# EAGLE schematic PCB30011-R2519 (EAGLE 5.06)
DM: 0; DR: 180.000; DX: 72.400; DY: 3.000; SHEETNO: 3

## Sheet 1 of 7
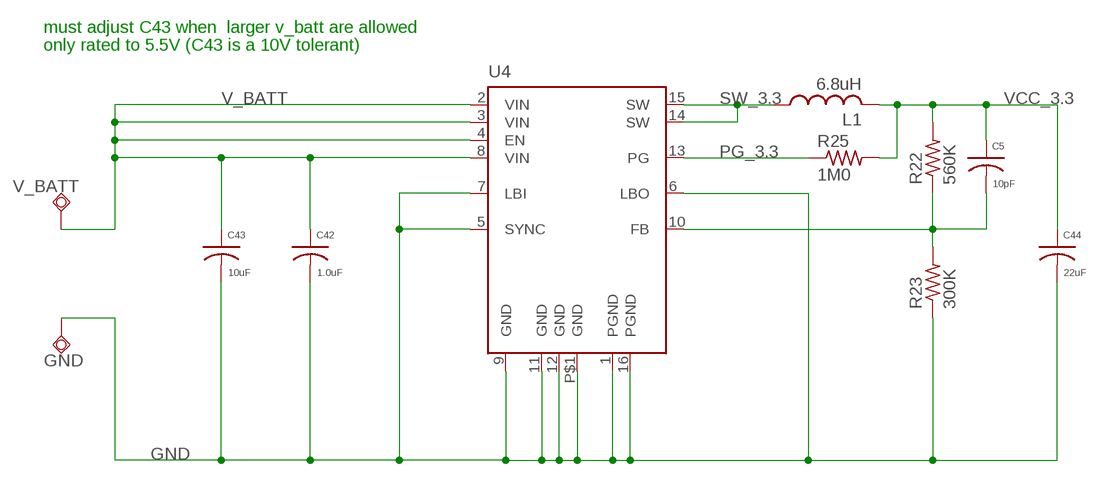
[diagram p0: schematic, sheet 1]

### Parts
C5  10pF  C0402  [C0402]
C42  1.0uF  C0603  [C0603]
C43  10uF  C0805  [C0805]
C44  22uF  C0805-R  [C0805R]
GND  TPSQPAD1-17  [P1-17]
L1  6.8uH  LELL3GM  [ELL3GM]
R22  560K  R0402-R  [C0402R]
R23  300K  R0402-R  [C0402R]
R25  1M0  R0402-R  [C0402R]
U4  TPS62110  TPS62111  [PQFP16]
V_BATT  TPSQPAD1-17  [P1-17]

### Nets
FB_3.3: C5.2 R22.1 R23.2 U4.10(FB)
GND [xxwide]: C42.2 C43.2 C44.2 GND.1(TP) R23.1 U4.1(PGND) U4.5(SYNC) U4.6(LBO) U4.7(LBI) U4.9(GND) U4.11(GND) U4.12(GND) U4.16(PGND) U4.P$1(GND) ; also sheet 2,3,4,5,6,7
PG_3.3: R25.1 U4.13(PG)
SW_3.3: L1.1 U4.14(SW) U4.15(SW)
V_BATT [xxwide]: C42.1 C43.1 U4.2(VIN) U4.3(VIN) U4.4(EN) U4.8(VIN) V_BATT.1(TP) ; also sheet 5
VCC_3.3 [supply]: C5.1 C44.1 L1.2 R22.2 R25.2 ; also sheet 3,4,5,6,7

### Notes on the sheet
- must adjust C43 when  larger v_batt are allowed
- only rated to 5.5V (C43 is a 10V tolerant)

## Sheet 2 of 7
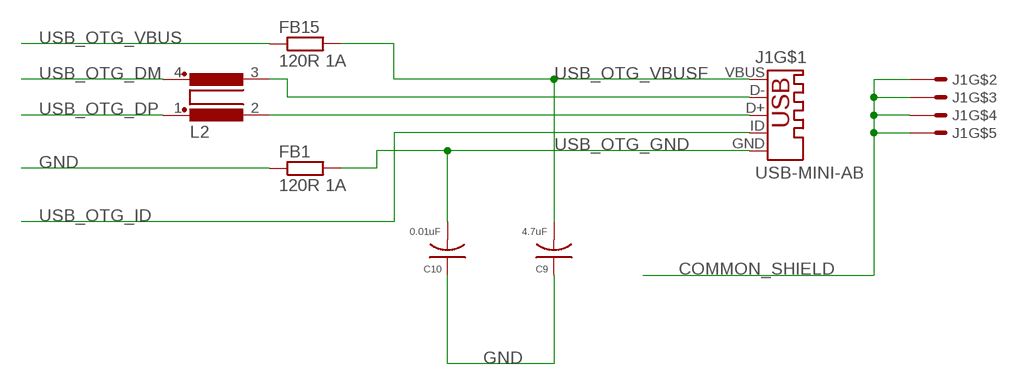
[diagram p1: schematic, sheet 2]

### Parts
C9  4.7uF  C0603-R  [C0603R]
C10  0.01uF  C0402  [C0402]
FB1  120R 1A  FB0402  [C0402]
FB15  120R 1A  FB0402  [C0402]
J1  USB-MINI-AB  USB-B  [USB-B-SMT]
L2  COM_MODE_CHOKE  [0504-DLP11S]

### Nets
COMMON_SHIELD: J1.P1(S) J1.P2(S) J1.P3(S) J1.P4(S)
GND [xxwide]: C9.1 C10.1 FB1.1 ; also sheet 1,3,4,5,6,7
USB_DM: J1.D-(2_D-) L2.3
USB_DP: J1.D+(3_D+) L2.2
USB_OTG_DM [USB]: L2.4 ; also sheet 3
USB_OTG_DP [USB]: L2.1 ; also sheet 3
USB_OTG_GND: C10.2 FB1.2 J1.GND(5_GND)
USB_OTG_ID: J1.ID(4_ID) ; also sheet 3
USB_OTG_VBUS [xxwide]: FB15.1 ; also sheet 3
USB_OTG_VBUSF: C9.2 FB15.2 J1.VBUS(1_VBUS)

## Sheet 3 of 7
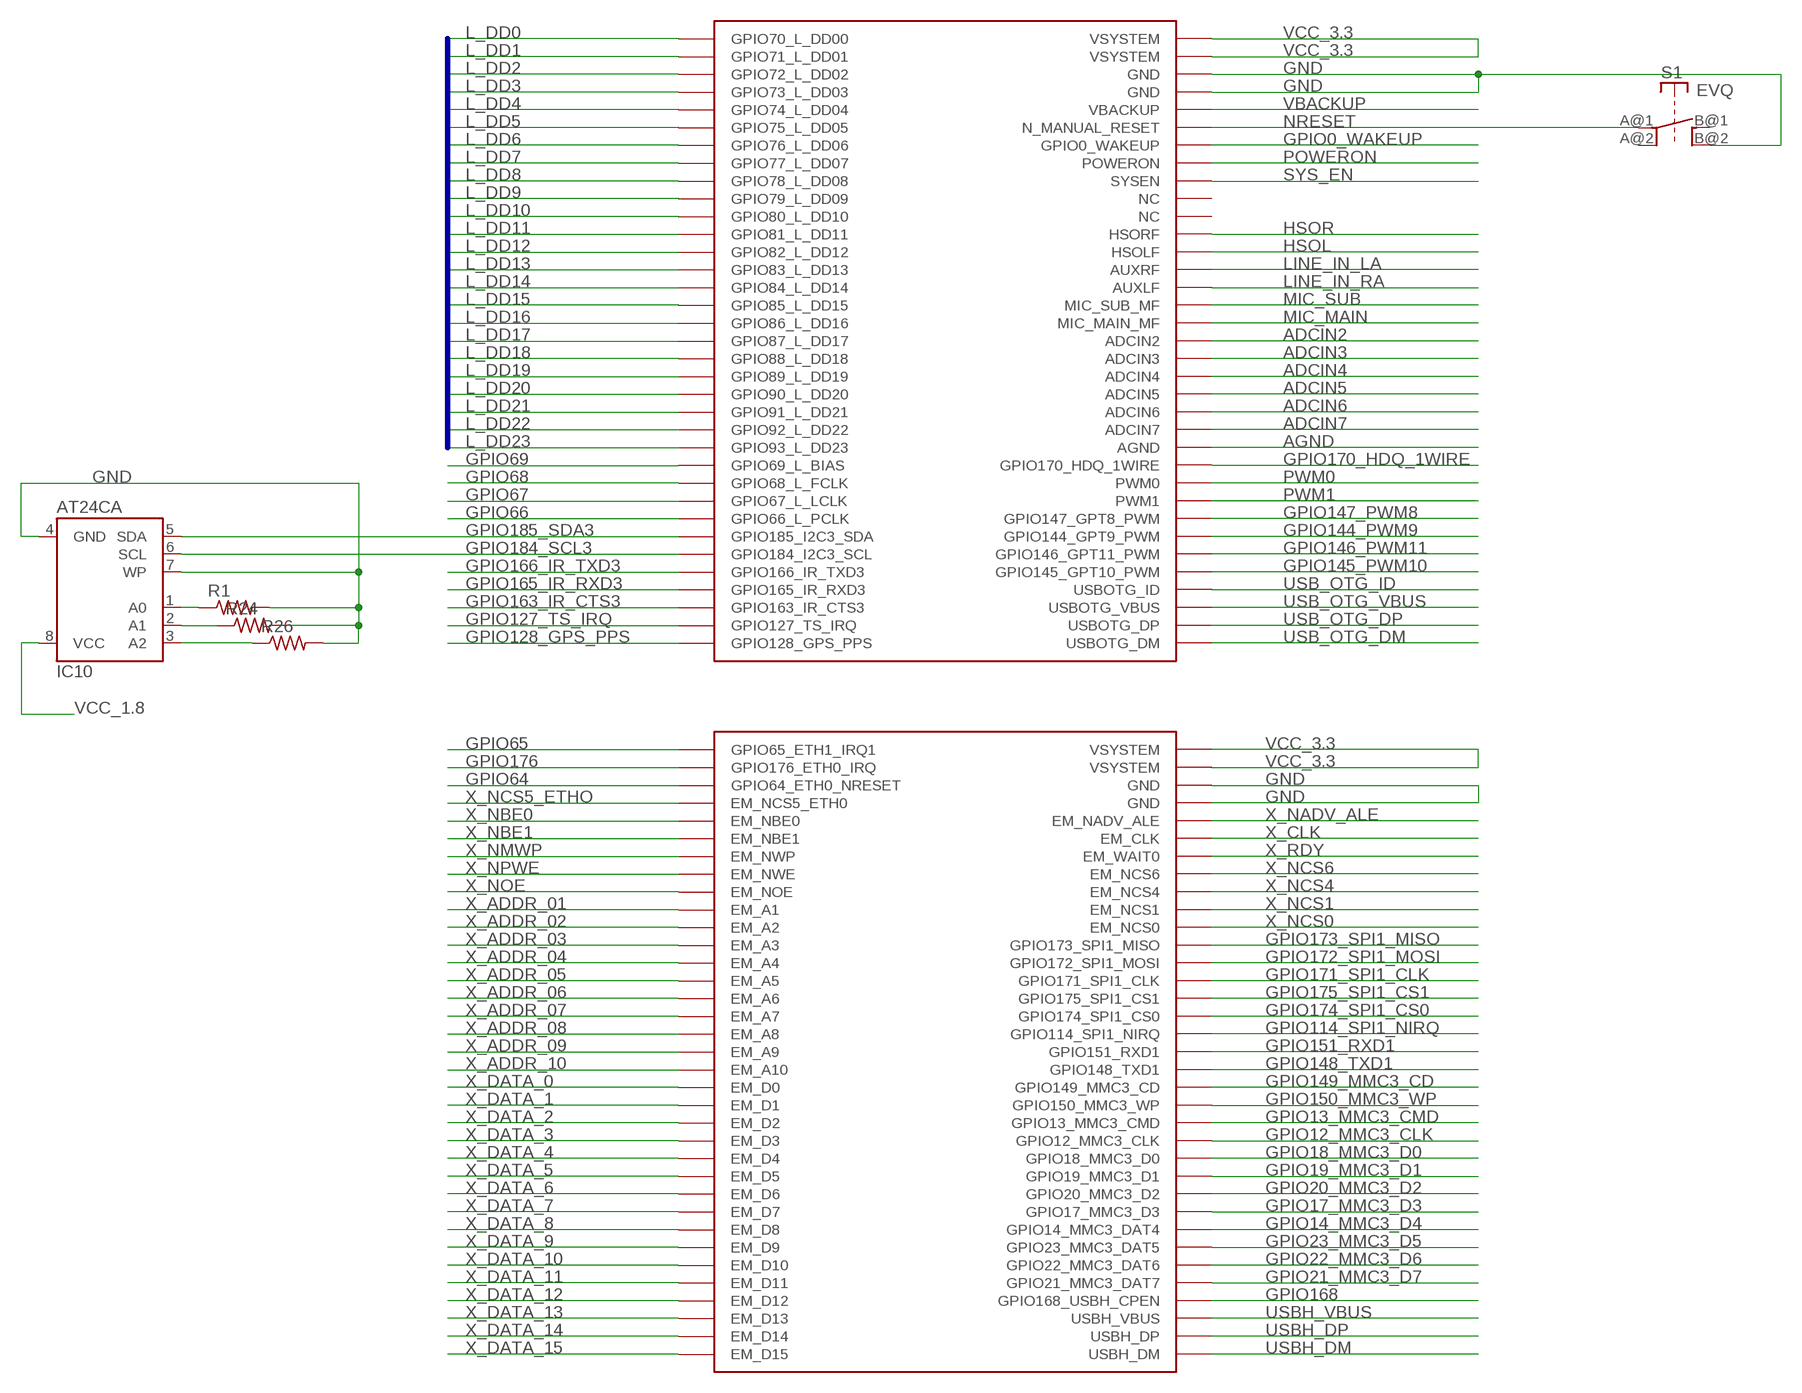
[diagram p2: schematic, sheet 3]

### Parts
IC10  AT24CA  [TSSOP8]
J3  OVERO  [OVERO]
R1  R0402  [C0402]
R24  R0402  [C0402]
R26  R0402  [C0402]
S1  EVQ  [EVQ]

### Nets
ADCIN2: J3.ADCIN2 ; also sheet 5
ADCIN3: J3.ADCIN3 ; also sheet 5
ADCIN4: J3.ADCIN4 ; also sheet 5
ADCIN5: J3.ADCIN5 ; also sheet 5
ADCIN6: J3.ADCIN6 ; also sheet 5
ADCIN7: J3.ADCIN7 ; also sheet 5
AGND: J3.AGND ; also sheet 5
EE_A0: IC10.1(A0) R1.1
EE_A1: IC10.2(A1) R24.1
EE_A2: IC10.3(A2) R26.1
GND [xxwide]: IC10.4(GND) IC10.7(WP) J3.GND J3.GND@33(GND) J3.GND@56(GND) J3.GND@70(GND) R1.2 R24.2 R26.2 S1.B@2(B') ; also sheet 1,2,4,5,6,7
GPIO0_WAKEUP: J3.GPIO0_WAKEUP ; also sheet 5
GPIO12_MMC3_CLK: J3.GPIO12_MMC3_CLK ; also sheet 5,6
GPIO13_MMC3_CMD: J3.GPIO13_MMC3_CMD ; also sheet 5,6
GPIO14_MMC3_D4: J3.GPIO14_MMC3_DAT4 ; also sheet 5,6
GPIO17_MMC3_D3: J3.GPIO17_MMC3_D3 ; also sheet 5,6
GPIO18_MMC3_D0: J3.GPIO18_MMC3_D0 ; also sheet 5,6
GPIO19_MMC3_D1: J3.GPIO19_MMC3_D1 ; also sheet 5,6
GPIO20_MMC3_D2: J3.GPIO20_MMC3_D2 ; also sheet 5,6
GPIO21_MMC3_D7: J3.GPIO21_MMC3_DAT7 ; also sheet 5,6
GPIO22_MMC3_D6: J3.GPIO22_MMC3_DAT6 ; also sheet 5,6
GPIO23_MMC3_D5: J3.GPIO23_MMC3_DAT5 ; also sheet 5,6
GPIO64: J3.GPIO64_ETH0_NRESET ; also sheet 5
GPIO65: J3.GPIO65_ETH1_IRQ1 ; also sheet 5
GPIO66: J3.GPIO66_L_PCLK ; also sheet 5,6
GPIO67: J3.GPIO67_L_LCLK ; also sheet 5,6
GPIO68: J3.GPIO68_L_FCLK ; also sheet 5,6
GPIO69: J3.GPIO69_L_BIAS ; also sheet 5,6
GPIO114_SPI1_NIRQ: J3.GPIO114_SPI1_NIRQ ; also sheet 5
GPIO127_TS_IRQ: J3.GPIO127_TS_IRQ ; also sheet 5
GPIO128_GPS_PPS: J3.GPIO128_GPS_PPS ; also sheet 5
GPIO144_PWM9: J3.GPIO144_GPT9_PWM ; also sheet 5
GPIO145_PWM10: J3.GPIO145_GPT10_PWM ; also sheet 5
GPIO146_PWM11: J3.GPIO146_GPT11_PWM ; also sheet 5
GPIO147_PWM8: J3.GPIO147_GPT8_PWM ; also sheet 5
GPIO148_TXD1: J3.GPIO148_TXD1 ; also sheet 5
GPIO149_MMC3_CD: J3.GPIO149_MMC3_CD ; also sheet 5,6
GPIO150_MMC3_WP: J3.GPIO150_MMC3_WP ; also sheet 5,6
GPIO151_RXD1: J3.GPIO151_RXD1 ; also sheet 5
GPIO163_IR_CTS3: J3.GPIO163_IR_CTS3 ; also sheet 5
GPIO165_IR_RXD3: J3.GPIO165_IR_RXD3 ; also sheet 5
GPIO166_IR_TXD3: J3.GPIO166_IR_TXD3 ; also sheet 5
GPIO168: J3.GPIO168_USBH_CPEN ; also sheet 5
GPIO170_HDQ_1WIRE: J3.GPIO170_HDQ_1WIRE ; also sheet 5
GPIO171_SPI1_CLK: J3.GPIO171_SPI1_CLK ; also sheet 5
GPIO172_SPI1_MOSI: J3.GPIO172_SPI1_MOSI ; also sheet 5
GPIO173_SPI1_MISO: J3.GPIO173_SPI1_MISO ; also sheet 5
GPIO174_SPI1_CS0: J3.GPIO174_SPI1_CS0 ; also sheet 5
GPIO175_SPI1_CS1: J3.GPIO175_SPI1_CS1 ; also sheet 5
GPIO176: J3.GPIO176_ETH0_IRQ ; also sheet 5
GPIO184_SCL3: IC10.6(SCL) J3.GPIO184_I2C3_SCL ; also sheet 5
GPIO185_SDA3: IC10.5(SDA) J3.GPIO185_I2C3_SDA ; also sheet 5
HSOL [analog]: J3.HSOLF
HSOR [analog]: J3.HSORF
L_DD0: J3.GPIO70_L_DD00
L_DD1: J3.GPIO71_L_DD01
L_DD2: J3.GPIO72_L_DD02
L_DD3: J3.GPIO73_L_DD03
L_DD4: J3.GPIO74_L_DD04
L_DD5: J3.GPIO75_L_DD05
L_DD6: J3.GPIO76_L_DD06
L_DD7: J3.GPIO77_L_DD07
L_DD8: J3.GPIO78_L_DD08
L_DD9: J3.GPIO79_L_DD09
L_DD10: J3.GPIO80_L_DD10
L_DD11: J3.GPIO81_L_DD11
L_DD12: J3.GPIO82_L_DD12
L_DD13: J3.GPIO83_L_DD13
L_DD14: J3.GPIO84_L_DD14
L_DD15: J3.GPIO85_L_DD15
L_DD16: J3.GPIO86_L_DD16
L_DD17: J3.GPIO87_L_DD17
L_DD18: J3.GPIO88_L_DD18
L_DD19: J3.GPIO89_L_DD19
L_DD20: J3.GPIO90_L_DD20
L_DD21: J3.GPIO91_L_DD21
L_DD22: J3.GPIO92_L_DD22
L_DD23: J3.GPIO93_L_DD23
LINE_IN_LA [analog]: J3.AUXRF
LINE_IN_RA [analog]: J3.AUXLF
MIC_MAIN: J3.MIC_MAIN_MF
MIC_SUB: J3.MIC_SUB_MF
NRESET: J3.N_MANUAL_RESET S1.A@1(A)
POWERON: J3.POWERON ; also sheet 5
PWM0: J3.PWM0 ; also sheet 5
PWM1: J3.PWM1 ; also sheet 5
SYS_EN: J3.SYSEN ; also sheet 4,5
USB_OTG_DM [USB]: J3.USBOTG_DM ; also sheet 2
USB_OTG_DP [USB]: J3.USBOTG_DP ; also sheet 2
USB_OTG_ID: J3.USBOTG_ID ; also sheet 2
USB_OTG_VBUS [xxwide]: J3.USBOTG_VBUS ; also sheet 2
USBH_DM [USB]: J3.USBH_DM
USBH_DP [USB]: J3.USBH_DP
USBH_VBUS [xxwide]: J3.USBH_VBUS
VBACKUP: J3.VBACKUP ; also sheet 5
VCC_1.8 [supply]: IC10.8(VCC) ; also sheet 4,5,6,7
VCC_3.3 [supply]: J3.VSYSTEM@1(VSYSTEM) J3.VSYSTEM@2(VSYSTEM) J3.VSYSTEM@66(VSYSTEM) J3.VSYSTEM@67(VSYSTEM) ; also sheet 1,4,5,6,7
X_ADDR_01: J3.EM_A1
X_ADDR_02: J3.EM_A2
X_ADDR_03: J3.EM_A3
X_ADDR_04: J3.EM_A4
X_ADDR_05: J3.EM_A5
X_ADDR_06: J3.EM_A6
X_ADDR_07: J3.EM_A7
X_ADDR_08: J3.EM_A8
X_ADDR_09: J3.EM_A9
X_ADDR_10: J3.EM_A10
X_CLK: J3.EM_CLK
X_DATA_0: J3.EM_D0
X_DATA_1: J3.EM_D1
X_DATA_2: J3.EM_D2
X_DATA_3: J3.EM_D3
X_DATA_4: J3.EM_D4
X_DATA_5: J3.EM_D5
X_DATA_6: J3.EM_D6
X_DATA_7: J3.EM_D7
X_DATA_8: J3.EM_D8
X_DATA_9: J3.EM_D9
X_DATA_10: J3.EM_D10
X_DATA_11: J3.EM_D11
X_DATA_12: J3.EM_D12
X_DATA_13: J3.EM_D13
X_DATA_14: J3.EM_D14
X_DATA_15: J3.EM_D15
X_NADV_ALE: J3.EM_NADV_ALE
X_NBE0: J3.EM_NBE0
X_NBE1: J3.EM_NBE1
X_NCS0: J3.EM_NCS0
X_NCS1: J3.EM_NCS1
X_NCS4: J3.EM_NCS4
X_NCS5_ETHO: J3.EM_NCS5_ETH0
X_NCS6: J3.EM_NCS6
X_NMWP: J3.EM_NWP
X_NOE: J3.EM_NOE
X_NPWE: J3.EM_NWE
X_RDY: J3.EM_WAIT0
Unconnected: J3.NC@62(NC) J3.NC@63(NC) S1.A@2(A') S1.B@1(B)

### Buses
L_DD[0..23]

## Sheet 4 of 7
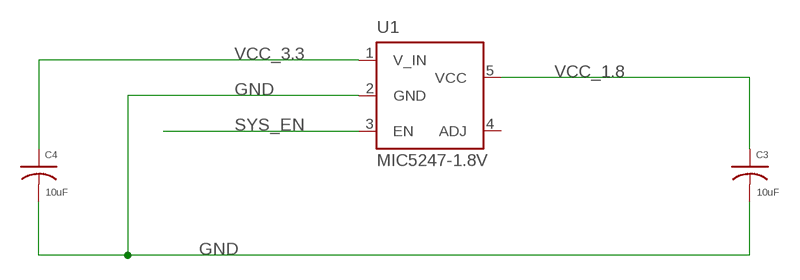
[diagram p3: schematic, sheet 4]

### Parts
C3  10uF  C0603  [C0603]
C4  10uF  C0603  [C0603]
U1  MIC5247-1.8V  MIC5219YM5  [SOT-23-5]

### Nets
GND [xxwide]: C3.2 C4.2 U1.2(GND) ; also sheet 1,2,3,5,6,7
SYS_EN: U1.3(EN) ; also sheet 3,5
VCC_1.8 [supply]: C3.1 U1.5(VCC) ; also sheet 3,5,6,7
VCC_3.3 [supply]: C4.1 U1.1(V_IN) ; also sheet 1,3,5,6,7
Unconnected: U1.4(ADJ)

## Sheet 5 of 7
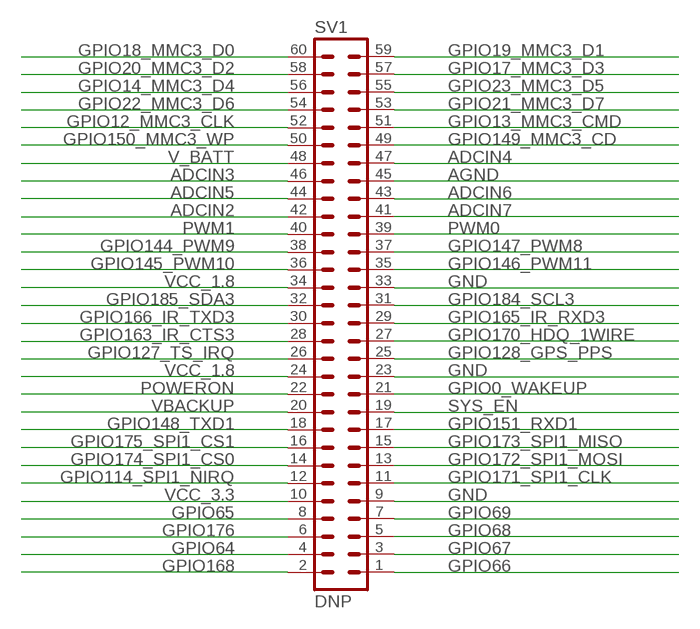
[diagram p4: schematic, sheet 5]

### Parts
SV1  DNP  MA30-2  [DIL60]

### Nets
ADCIN2: SV1.42 ; also sheet 3
ADCIN3: SV1.46 ; also sheet 3
ADCIN4: SV1.47 ; also sheet 3
ADCIN5: SV1.44 ; also sheet 3
ADCIN6: SV1.43 ; also sheet 3
ADCIN7: SV1.41 ; also sheet 3
AGND: SV1.45 ; also sheet 3
GND [xxwide]: SV1.9 SV1.23 SV1.33 ; also sheet 1,2,3,4,6,7
GPIO0_WAKEUP: SV1.21 ; also sheet 3
GPIO12_MMC3_CLK: SV1.52 ; also sheet 3,6
GPIO13_MMC3_CMD: SV1.51 ; also sheet 3,6
GPIO14_MMC3_D4: SV1.56 ; also sheet 3,6
GPIO17_MMC3_D3: SV1.57 ; also sheet 3,6
GPIO18_MMC3_D0: SV1.60 ; also sheet 3,6
GPIO19_MMC3_D1: SV1.59 ; also sheet 3,6
GPIO20_MMC3_D2: SV1.58 ; also sheet 3,6
GPIO21_MMC3_D7: SV1.53 ; also sheet 3,6
GPIO22_MMC3_D6: SV1.54 ; also sheet 3,6
GPIO23_MMC3_D5: SV1.55 ; also sheet 3,6
GPIO64: SV1.4 ; also sheet 3
GPIO65: SV1.8 ; also sheet 3
GPIO66: SV1.1 ; also sheet 3,6
GPIO67: SV1.3 ; also sheet 3,6
GPIO68: SV1.5 ; also sheet 3,6
GPIO69: SV1.7 ; also sheet 3,6
GPIO114_SPI1_NIRQ: SV1.12 ; also sheet 3
GPIO127_TS_IRQ: SV1.26 ; also sheet 3
GPIO128_GPS_PPS: SV1.25 ; also sheet 3
GPIO144_PWM9: SV1.38 ; also sheet 3
GPIO145_PWM10: SV1.36 ; also sheet 3
GPIO146_PWM11: SV1.35 ; also sheet 3
GPIO147_PWM8: SV1.37 ; also sheet 3
GPIO148_TXD1: SV1.18 ; also sheet 3
GPIO149_MMC3_CD: SV1.49 ; also sheet 3,6
GPIO150_MMC3_WP: SV1.50 ; also sheet 3,6
GPIO151_RXD1: SV1.17 ; also sheet 3
GPIO163_IR_CTS3: SV1.28 ; also sheet 3
GPIO165_IR_RXD3: SV1.29 ; also sheet 3
GPIO166_IR_TXD3: SV1.30 ; also sheet 3
GPIO168: SV1.2 ; also sheet 3
GPIO170_HDQ_1WIRE: SV1.27 ; also sheet 3
GPIO171_SPI1_CLK: SV1.11 ; also sheet 3
GPIO172_SPI1_MOSI: SV1.13 ; also sheet 3
GPIO173_SPI1_MISO: SV1.15 ; also sheet 3
GPIO174_SPI1_CS0: SV1.14 ; also sheet 3
GPIO175_SPI1_CS1: SV1.16 ; also sheet 3
GPIO176: SV1.6 ; also sheet 3
GPIO184_SCL3: SV1.31 ; also sheet 3
GPIO185_SDA3: SV1.32 ; also sheet 3
POWERON: SV1.22 ; also sheet 3
PWM0: SV1.39 ; also sheet 3
PWM1: SV1.40 ; also sheet 3
SYS_EN: SV1.19 ; also sheet 3,4
V_BATT [xxwide]: SV1.48 ; also sheet 1
VBACKUP: SV1.20 ; also sheet 3
VCC_1.8 [supply]: SV1.24 SV1.34 ; also sheet 3,4,6,7
VCC_3.3 [supply]: SV1.10 ; also sheet 1,3,4,6,7

## Sheet 6 of 7
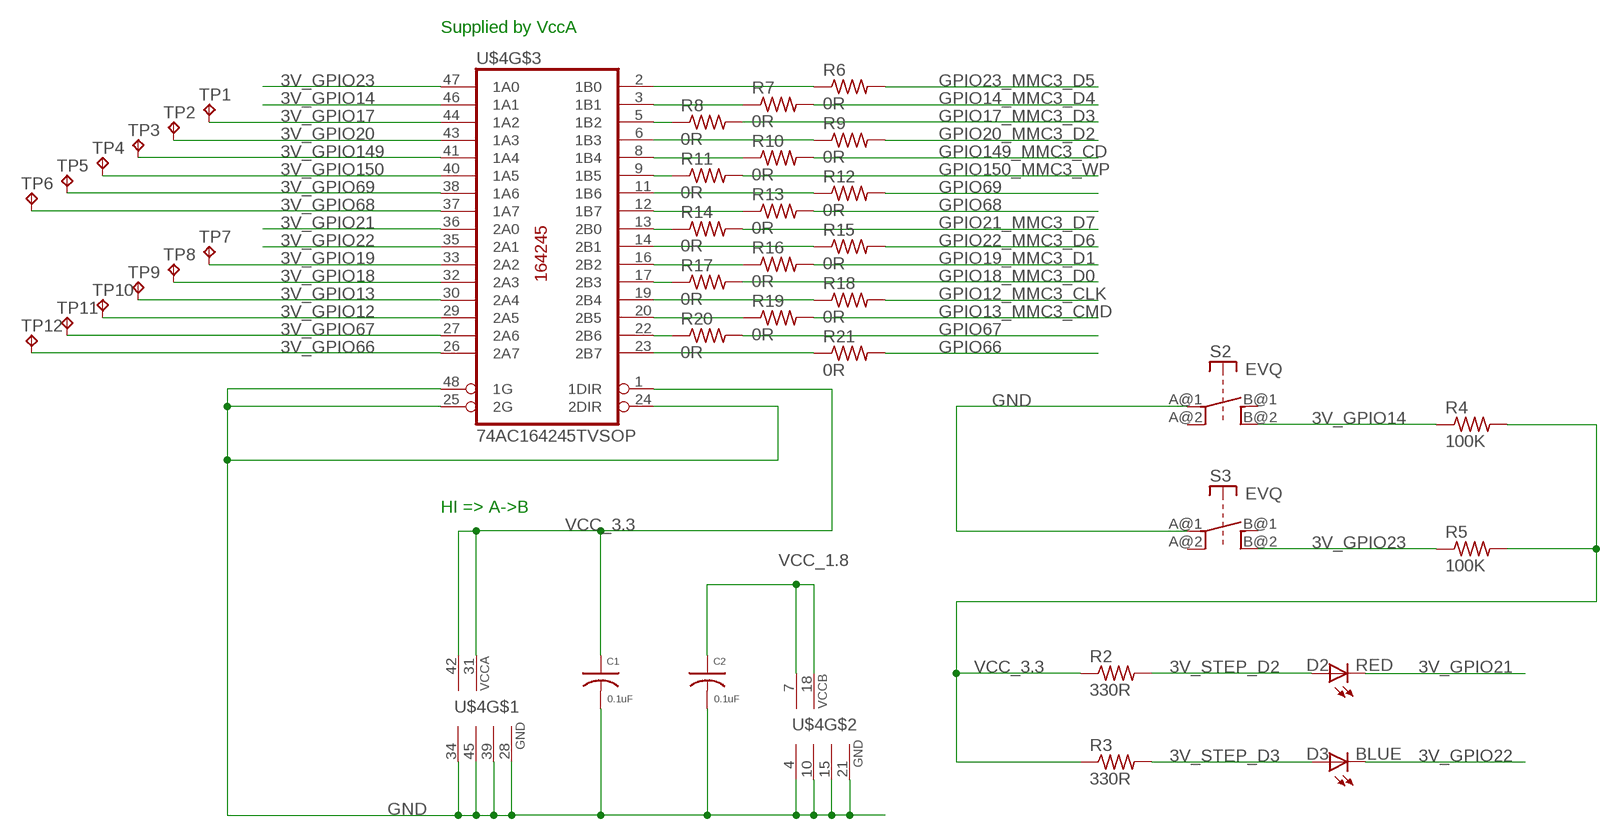
[diagram p5: schematic, sheet 6]

### Parts
C1  0.1uF  C0402-R  [C0402R]
C2  0.1uF  C0402-R  [C0402R]
D2  RED  LED0603-R  [D0603R]
D3  BLUE  LED0603  [D0603]
R2  330R  R0402  [C0402]
R3  330R  R0402-R  [C0402R]
R4  100K  R0402  [C0402]
R5  100K  R0402  [C0402]
R6  0R  R0603  [C0603]
R7  0R  R0603  [C0603]
R8  0R  R0603  [C0603]
R9  0R  R0603  [C0603]
R10  0R  R0603  [C0603]
R11  0R  R0603  [C0603]
R12  0R  R0603  [C0603]
R13  0R  R0603  [C0603]
R14  0R  R0603  [C0603]
R15  0R  R0603  [C0603]
R16  0R  R0603  [C0603]
R17  0R  R0603  [C0603]
R18  0R  R0603  [C0603]
R19  0R  R0603  [C0603]
R20  0R  R0603  [C0603]
R21  0R  R0603  [C0603]
S2  EVQ  [EVQ]
S3  EVQ  [EVQ]
TP1  TPB1,27  [B1,27]
TP2  TPB1,27  [B1,27]
TP3  TPB1,27  [B1,27]
TP4  TPB1,27  [B1,27]
TP5  TPB1,27  [B1,27]
TP6  TPB1,27  [B1,27]
TP7  TPB1,27  [B1,27]
TP8  TPB1,27  [B1,27]
TP9  TPB1,27  [B1,27]
TP10  TPB1,27  [B1,27]
TP11  TPB1,27  [B1,27]
TP12  TPB1,27  [B1,27]
U$4  74AC164245TVSOP  [TVSOP48]

### Nets
3V_GPIO12: TP10.PP(TP) U$4.29(2A5)
3V_GPIO13: TP9.PP(TP) U$4.30(2A4)
3V_GPIO14: R4.1 S2.B@2(B') U$4.46(1A1)
3V_GPIO17: TP1.PP(TP) U$4.44(1A2)
3V_GPIO18: TP8.PP(TP) U$4.32(2A3)
3V_GPIO19: TP7.PP(TP) U$4.33(2A2)
3V_GPIO20: TP2.PP(TP) U$4.43(1A3)
3V_GPIO21: D2.C U$4.36(2A0)
3V_GPIO22: D3.C U$4.35(2A1)
3V_GPIO23: R5.1 S3.B@2(B') U$4.47(1A0)
3V_GPIO66: TP12.PP(TP) U$4.26(2A7)
3V_GPIO67: TP11.PP(TP) U$4.27(2A6)
3V_GPIO68: TP6.PP(TP) U$4.37(1A7)
3V_GPIO69: TP5.PP(TP) U$4.38(1A6)
3V_GPIO149: TP3.PP(TP) U$4.41(1A4)
3V_GPIO150: TP4.PP(TP) U$4.40(1A5)
3V_STEP_D2: D2.A R2.2
3V_STEP_D3: D3.A R3.2
GND [xxwide]: C1.2 C2.2 S2.A@1(A) S3.A@1(A) U$4.4(GND) U$4.10(GND) U$4.15(GND) U$4.21(GND) U$4.24(2DIR) U$4.25(2G) U$4.28(GND) U$4.34(GND) U$4.39(GND) U$4.45(GND) U$4.48(1G) ; also sheet 1,2,3,4,5,7
GPIO12_2B4: R18.1 U$4.19(2B4)
GPIO12_MMC3_CLK: R18.2 ; also sheet 3,5
GPIO13_2B5: R19.1 U$4.20(2B5)
GPIO13_MMC3_CMD: R19.2 ; also sheet 3,5
GPIO14_1B1: R7.1 U$4.3(1B1)
GPIO14_MMC3_D4: R7.2 ; also sheet 3,5
GPIO17_1B2: R8.1 U$4.5(1B2)
GPIO17_MMC3_D3: R8.2 ; also sheet 3,5
GPIO18_2B3: R17.1 U$4.17(2B3)
GPIO18_MMC3_D0: R17.2 ; also sheet 3,5
GPIO19_2B2: R16.1 U$4.16(2B2)
GPIO19_MMC3_D1: R16.2 ; also sheet 3,5
GPIO20_1B3: R9.1 U$4.6(1B3)
GPIO20_MMC3_D2: R9.2 ; also sheet 3,5
GPIO21_2B0: R14.1 U$4.13(2B0)
GPIO21_MMC3_D7: R14.2 ; also sheet 3,5
GPIO22_2B1: R15.1 U$4.14(2B1)
GPIO22_MMC3_D6: R15.2 ; also sheet 3,5
GPIO23_1B0: R6.1 U$4.2(1B0)
GPIO23_MMC3_D5: R6.2 ; also sheet 3,5
GPIO66: R21.2 ; also sheet 3,5
GPIO66_2B7: R21.1 U$4.23(2B7)
GPIO67: R20.2 ; also sheet 3,5
GPIO67_2B6: R20.1 U$4.22(2B6)
GPIO68: R13.2 ; also sheet 3,5
GPIO68_1B7: R13.1 U$4.12(1B7)
GPIO69: R12.2 ; also sheet 3,5
GPIO69_1B6: R12.1 U$4.11(1B6)
GPIO149_1B4: R10.1 U$4.8(1B4)
GPIO149_MMC3_CD: R10.2 ; also sheet 3,5
GPIO150_1B5: R11.1 U$4.9(1B5)
GPIO150_MMC3_WP: R11.2 ; also sheet 3,5
VCC_1.8 [supply]: C2.1 U$4.7(VCCB) U$4.18(VCCB) ; also sheet 3,4,5,7
VCC_3.3 [supply]: C1.1 R2.1 R3.1 R4.2 R5.2 U$4.1(1DIR) U$4.31(VCCA) U$4.42(VCCA) ; also sheet 1,3,4,5,7
Unconnected: S2.A@2(A') S2.B@1(B) S3.A@2(A') S3.B@1(B)

### Notes on the sheet
- Supplied by VccA
- HI => A->B

## Sheet 7 of 7
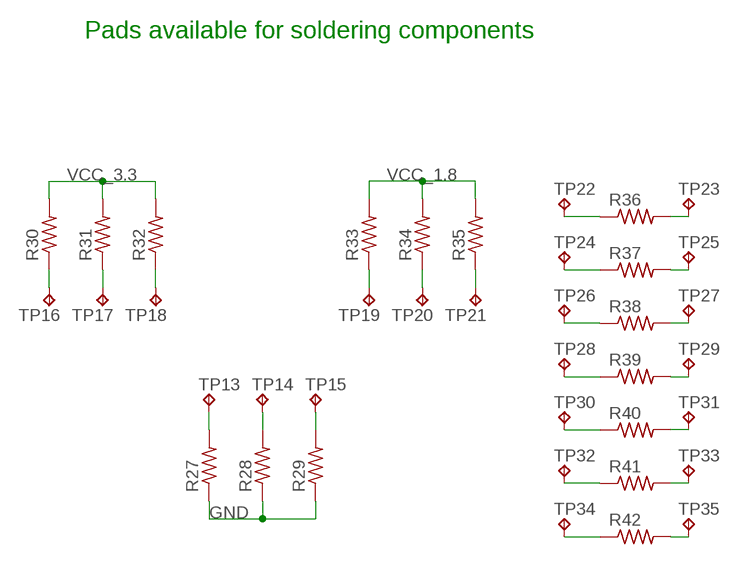
[diagram p6: schematic, sheet 7]

### Parts
R27  R0603  [C0603]
R28  R0603  [C0603]
R29  R0603  [C0603]
R30  R0603  [C0603]
R31  R0603  [C0603]
R32  R0603  [C0603]
R33  R0603  [C0603]
R34  R0603  [C0603]
R35  R0603  [C0603]
R36  R0603  [C0603]
R37  R0603  [C0603]
R38  R0603  [C0603]
R39  R0603  [C0603]
R40  R0603  [C0603]
R41  R0603  [C0603]
R42  R0603  [C0603]
TP13  TPB1,27  [B1,27]
TP14  TPB1,27  [B1,27]
TP15  TPB1,27  [B1,27]
TP16  TPB1,27  [B1,27]
TP17  TPB1,27  [B1,27]
TP18  TPB1,27  [B1,27]
TP19  TPB1,27  [B1,27]
TP20  TPB1,27  [B1,27]
TP21  TPB1,27  [B1,27]
TP22  TPB1,27  [B1,27]
TP23  TPB1,27  [B1,27]
TP24  TPB1,27  [B1,27]
TP25  TPB1,27  [B1,27]
TP26  TPB1,27  [B1,27]
TP27  TPB1,27  [B1,27]
TP28  TPB1,27  [B1,27]
TP29  TPB1,27  [B1,27]
TP30  TPB1,27  [B1,27]
TP31  TPB1,27  [B1,27]
TP32  TPB1,27  [B1,27]
TP33  TPB1,27  [B1,27]
TP34  TPB1,27  [B1,27]
TP35  TPB1,27  [B1,27]

### Nets
GND [xxwide]: R27.1 R28.1 R29.1 ; also sheet 1,2,3,4,5,6
TP13: R27.2 TP13.PP(TP)
TP14: R28.2 TP14.PP(TP)
TP15: R29.2 TP15.PP(TP)
TP16: R30.1 TP16.PP(TP)
TP17: R31.1 TP17.PP(TP)
TP18: R32.1 TP18.PP(TP)
TP19: R33.1 TP19.PP(TP)
TP20: R34.1 TP20.PP(TP)
TP21: R35.1 TP21.PP(TP)
TP22: R36.1 TP22.PP(TP)
TP23: R36.2 TP23.PP(TP)
TP24: R37.1 TP24.PP(TP)
TP25: R37.2 TP25.PP(TP)
TP26: R38.1 TP26.PP(TP)
TP27: R38.2 TP27.PP(TP)
TP28: R39.1 TP28.PP(TP)
TP29: R39.2 TP29.PP(TP)
TP30: R40.1 TP30.PP(TP)
TP31: R40.2 TP31.PP(TP)
TP32: R41.1 TP32.PP(TP)
TP33: R41.2 TP33.PP(TP)
TP34: R42.1 TP34.PP(TP)
TP35: R42.2 TP35.PP(TP)
VCC_1.8 [supply]: R33.2 R34.2 R35.2 ; also sheet 3,4,5,6
VCC_3.3 [supply]: R30.2 R31.2 R32.2 ; also sheet 1,3,4,5,6

### Notes on the sheet
- Pads available for soldering components

## Library data of the parts
C1-C5 C9 C10 C42-C44 = qualified_1:C
D2 D3 = qualified_1:LED
FB1 FB15 = qualified_1:FB
GND V_BATT = testpad:TPSQ: Test pad
IC10 = atmel:AT24C*: 2-wire serial EEPROM
J1 = qualified_1:USB-B
J3 = qualified_1:OVERO
L1 = qualified_1:L
L2 = qualified_MSD:COM_MODE_CHOKE
R1-R42 = qualified_1:R
S1-S3 = qualified_1:EVQ
SV1 = qualified_MSD:MA30-2
TP1-TP35 = testpad:TP: Test pad
U1 = qualified_1:MIC5219
U4 = qualified_1:TPS62111
U$4 = 74ac-logic:74AC164245

## Net classes
3 battery: width 0.203 mm
4 xxwide: width 0.203 mm
5 USB: width 0.191 mm